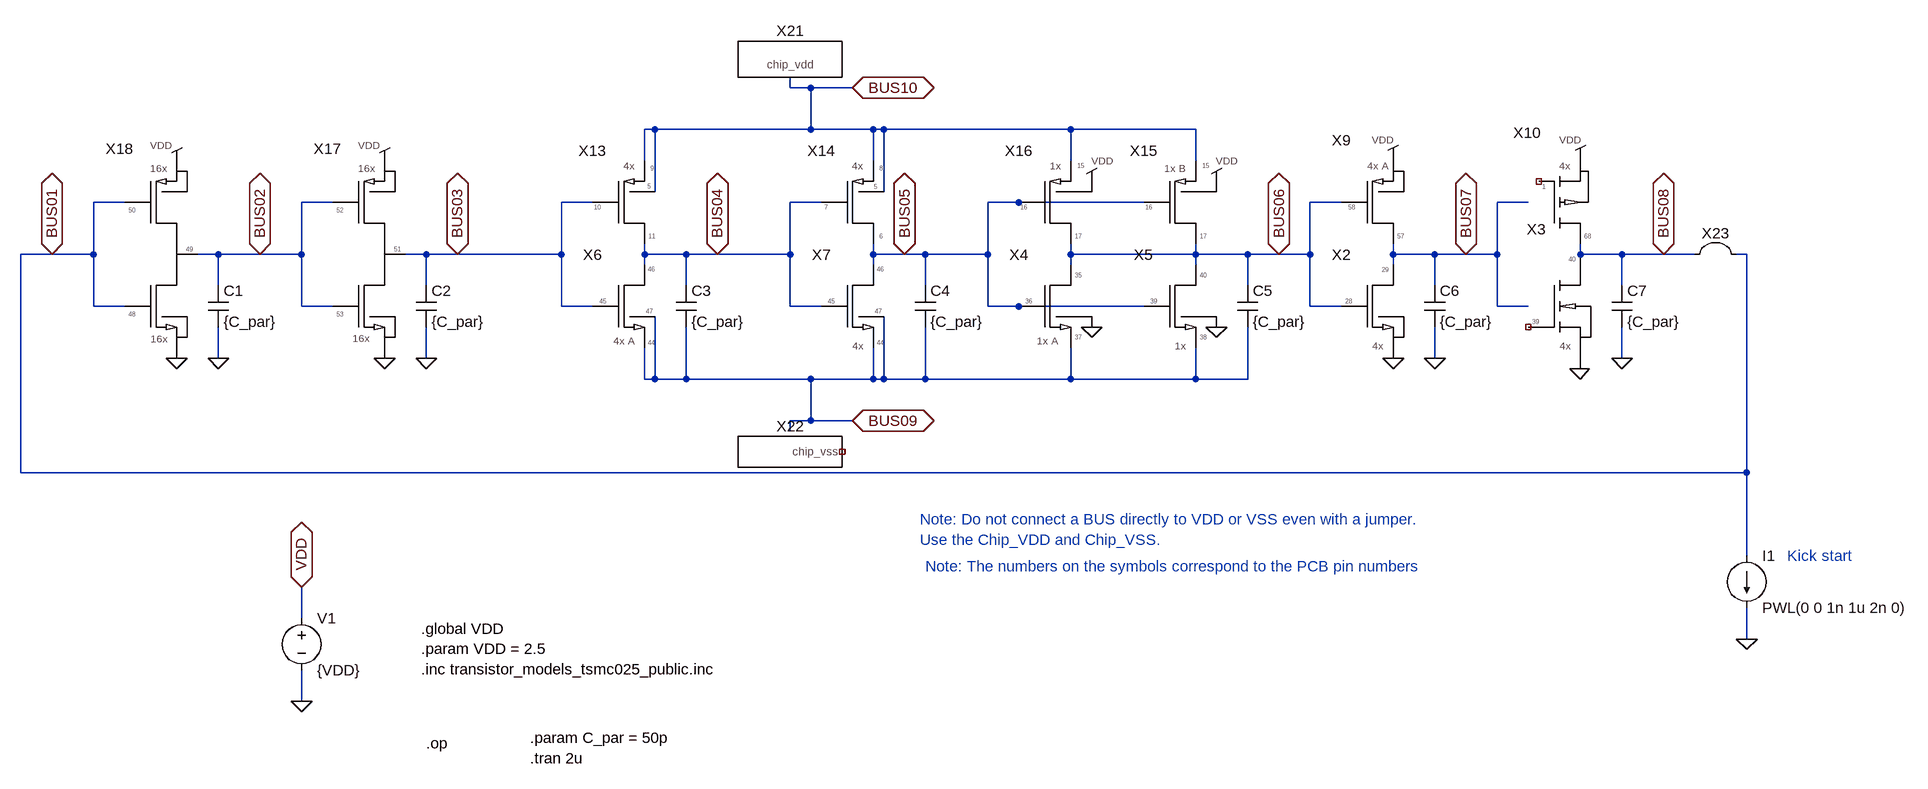
[diagram p0: schematic Example_Ring_Oscillator_7stage.asc]
Example_Ring_Oscillator_7stage.asc, the LTspice schematic file:
Version 4
SHEET 1 4480 996
WIRE 2752 -656 2752 -672
WIRE 2784 -656 2752 -656
WIRE 2848 -656 2784 -656
WIRE 2544 -592 2528 -592
WIRE 2784 -592 2784 -656
WIRE 2784 -592 2544 -592
WIRE 2880 -592 2784 -592
WIRE 2896 -592 2880 -592
WIRE 3184 -592 2896 -592
WIRE 3376 -592 3184 -592
WIRE 2528 -544 2528 -592
WIRE 2880 -544 2880 -592
WIRE 3184 -544 3184 -592
WIRE 3376 -544 3376 -592
WIRE 2544 -496 2544 -592
WIRE 2896 -496 2896 -592
WIRE 1728 -480 1680 -480
WIRE 2048 -480 2000 -480
WIRE 2448 -480 2400 -480
WIRE 2800 -480 2752 -480
WIRE 3104 -480 3056 -480
WIRE 3296 -480 3104 -480
WIRE 3600 -480 3552 -480
WIRE 3888 -480 3840 -480
WIRE 1616 -400 1568 -400
WIRE 1680 -400 1680 -480
WIRE 1680 -400 1616 -400
WIRE 1872 -400 1840 -400
WIRE 1936 -400 1872 -400
WIRE 2000 -400 2000 -480
WIRE 2000 -400 1936 -400
WIRE 2192 -400 2160 -400
WIRE 2240 -400 2192 -400
WIRE 2400 -400 2400 -480
WIRE 2400 -400 2240 -400
WIRE 2528 -400 2528 -416
WIRE 2592 -400 2528 -400
WIRE 2640 -400 2592 -400
WIRE 2752 -400 2752 -480
WIRE 2752 -400 2640 -400
WIRE 2880 -400 2880 -416
WIRE 2928 -400 2880 -400
WIRE 2960 -400 2928 -400
WIRE 3056 -400 3056 -480
WIRE 3056 -400 2960 -400
WIRE 3184 -400 3184 -416
WIRE 3376 -400 3376 -416
WIRE 3376 -400 3184 -400
WIRE 3456 -400 3376 -400
WIRE 3504 -400 3456 -400
WIRE 3552 -400 3552 -480
WIRE 3552 -400 3504 -400
WIRE 3680 -400 3680 -416
WIRE 3744 -400 3680 -400
WIRE 3792 -400 3744 -400
WIRE 3840 -400 3840 -480
WIRE 3840 -400 3792 -400
WIRE 3968 -400 3968 -416
WIRE 4032 -400 3968 -400
WIRE 4096 -400 4032 -400
WIRE 4144 -400 4096 -400
WIRE 4224 -400 4208 -400
WIRE 2528 -384 2528 -400
WIRE 2880 -384 2880 -400
WIRE 3184 -384 3184 -400
WIRE 3376 -384 3376 -400
WIRE 3680 -384 3680 -400
WIRE 3968 -384 3968 -400
WIRE 1872 -352 1872 -400
WIRE 2192 -352 2192 -400
WIRE 2592 -352 2592 -400
WIRE 2960 -352 2960 -400
WIRE 3456 -352 3456 -400
WIRE 3744 -352 3744 -400
WIRE 4032 -352 4032 -400
WIRE 1680 -320 1680 -400
WIRE 1728 -320 1680 -320
WIRE 2000 -320 2000 -400
WIRE 2048 -320 2000 -320
WIRE 2400 -320 2400 -400
WIRE 2448 -320 2400 -320
WIRE 2752 -320 2752 -400
WIRE 2800 -320 2752 -320
WIRE 3056 -320 3056 -400
WIRE 3104 -320 3056 -320
WIRE 3296 -320 3104 -320
WIRE 3552 -320 3552 -400
WIRE 3600 -320 3552 -320
WIRE 3840 -320 3840 -400
WIRE 3888 -320 3840 -320
WIRE 1872 -240 1872 -288
WIRE 2192 -240 2192 -288
WIRE 3744 -240 3744 -288
WIRE 4032 -240 4032 -288
WIRE 2528 -208 2528 -256
WIRE 2544 -208 2544 -304
WIRE 2544 -208 2528 -208
WIRE 2592 -208 2592 -288
WIRE 2592 -208 2544 -208
WIRE 2784 -208 2592 -208
WIRE 2880 -208 2880 -256
WIRE 2880 -208 2784 -208
WIRE 2896 -208 2896 -304
WIRE 2896 -208 2880 -208
WIRE 2960 -208 2960 -288
WIRE 2960 -208 2896 -208
WIRE 3184 -208 3184 -256
WIRE 3184 -208 2960 -208
WIRE 3376 -208 3376 -256
WIRE 3376 -208 3184 -208
WIRE 3456 -208 3456 -288
WIRE 3456 -208 3376 -208
WIRE 2784 -144 2784 -208
WIRE 2784 -144 2752 -144
WIRE 2848 -144 2784 -144
WIRE 2752 -128 2752 -144
WIRE 1568 -64 1568 -400
WIRE 4224 -64 4224 -400
WIRE 4224 -64 1568 -64
WIRE 4224 64 4224 -64
WIRE 2000 160 2000 112
WIRE 4224 192 4224 144
WIRE 2000 288 2000 240
FLAG 1616 -400 BUS01
IOPIN 1616 -400 BiDir
FLAG 1936 -400 BUS02
IOPIN 1936 -400 BiDir
FLAG 2240 -400 BUS03
IOPIN 2240 -400 BiDir
FLAG 2640 -400 BUS04
IOPIN 2640 -400 BiDir
FLAG 2928 -400 BUS05
IOPIN 2928 -400 BiDir
FLAG 3504 -400 BUS06
IOPIN 3504 -400 BiDir
FLAG 3792 -400 BUS07
IOPIN 3792 -400 BiDir
FLAG 4096 -400 BUS08
IOPIN 4096 -400 BiDir
FLAG 2848 -144 BUS09
IOPIN 2848 -144 BiDir
FLAG 2848 -656 BUS10
IOPIN 2848 -656 BiDir
FLAG 2000 112 VDD
IOPIN 2000 112 BiDir
FLAG 2000 288 0
FLAG 1872 -240 0
FLAG 4224 192 0
FLAG 2192 -240 0
FLAG 3744 -240 0
FLAG 4032 -240 0
SYMBOL DP_nMOS_1x_A 3136 -368 R0
SYMATTR InstName X4
SYMBOL DP_nMOS_1x_B 3328 -368 R0
SYMATTR InstName X5
SYMBOL CS_nMOS_4x_A 3632 -368 R0
SYMATTR InstName X2
SYMBOL DP_nMOS_4x_A 2480 -368 R0
SYMATTR InstName X6
SYMBOL DP_nMOS_4x_B 2832 -368 R0
SYMATTR InstName X7
SYMBOL voltage 2000 144 R0
SYMATTR InstName V1
SYMATTR Value {VDD}
SYMBOL CS_pMOS_4x_A 3616 -528 R0
SYMATTR InstName X9
SYMBOL CS_pMOS_4x_B 3904 -528 R0
SYMATTR InstName X10
SYMBOL CS_nMOS_4x_B 3920 -368 R0
SYMATTR InstName X3
SYMBOL DP_pMOS_4x_A 2464 -528 R0
SYMATTR InstName X13
SYMBOL DP_pMOS_4x_B 2816 -528 R0
SYMATTR InstName X14
SYMBOL DP_pMOS_1x_B 3312 -528 R0
SYMATTR InstName X15
SYMBOL DP_pMOS_1x_A 3120 -528 R0
SYMATTR InstName X16
SYMBOL inverter_A 2064 -528 R0
WINDOW 0 -24 -19 Bottom 2
SYMATTR InstName X17
SYMBOL inverter_B 1744 -528 R0
WINDOW 0 -24 -19 Bottom 2
SYMATTR InstName X18
SYMBOL chip_vdd 2752 -704 R0
SYMATTR InstName X21
SYMBOL chip_vss 2752 -96 R0
SYMATTR InstName X22
SYMBOL Misc/jumper 4176 -464 R0
SYMATTR InstName X23
SYMBOL Cap 1856 -352 R0
SYMATTR InstName C1
SYMATTR Value {C_par}
SYMBOL current 4224 64 R0
SYMATTR InstName I1
SYMATTR Value PWL(0 0 1n 1u 2n 0)
SYMBOL Cap 2176 -352 R0
SYMATTR InstName C2
SYMATTR Value {C_par}
SYMBOL Cap 2576 -352 R0
SYMATTR InstName C3
SYMATTR Value {C_par}
SYMBOL Cap 2944 -352 R0
SYMATTR InstName C4
SYMATTR Value {C_par}
SYMBOL Cap 3440 -352 R0
SYMATTR InstName C5
SYMATTR Value {C_par}
SYMBOL Cap 3728 -352 R0
SYMATTR InstName C6
SYMATTR Value {C_par}
SYMBOL Cap 4016 -352 R0
SYMATTR InstName C7
SYMATTR Value {C_par}
TEXT 2184 176 Left 2 !.global VDD\n.param VDD = 2.5\n.inc transistor_models_tsmc025_public.inc
TEXT 2192 352 Left 2 !.op
TEXT 2952 8 Left 2 ;Note: Do not connect a BUS directly to VDD or VSS even with a jumper. \nUse the Chip_VDD and Chip_VSS.
TEXT 2960 80 Left 2 ;Note: The numbers on the symbols correspond to the PCB pin numbers
TEXT 2352 344 Left 2 !.param C_par = 50p\n.tran 2u
TEXT 4336 64 Center 2 ;Kick start

The netlist it stands for:
* Example_Ring_Oscillator_7stage.asc
XX4 BUS05 BUS06 BUS09 DP_nMOS_1x_A  ; pins gate drain source
XX5 BUS05 BUS06 BUS09 DP_nMOS_1x_B  ; pins gate drain source
XX2 BUS06 BUS07 CS_nMOS_4x_A  ; pins gate drain
XX6 BUS03 BUS04 BUS09 BUS09 DP_nMOS_4x_A  ; pins gate drain source substrate
XX7 BUS04 BUS05 BUS09 BUS09 DP_nMOS_4x_B  ; pins gate drain source substrate
V1 VDD 0 {VDD}
XX9 BUS07 BUS06 CS_pMOS_4x_A  ; pins drain gate
XX10 BUS08 NC_01 CS_pMOS_4x_B  ; pins drain gate
XX3 NC_02 BUS08 CS_nMOS_4x_B  ; pins gate drain
XX13 BUS04 BUS03 BUS10 BUS10 DP_pMOS_4x_A  ; pins drain gate source nwell
XX14 BUS05 BUS04 BUS10 BUS10 DP_pMOS_4x_B  ; pins drain gate source nwell
XX15 BUS06 BUS05 BUS10 DP_pMOS_1x_B  ; pins drain gate source
XX16 BUS06 BUS05 BUS10 DP_pMOS_1x_A  ; pins drain gate source
XX17 BUS02 BUS02 BUS03 inverter_A  ; pins inn inp out
XX18 BUS08 BUS08 BUS02 inverter_B  ; pins inn inp out
XX21 BUS10 chip_vdd  ; pins chip_vdd
XX22 NC_03 chip_vss  ; pins chip_vss
C1 BUS02 0 {C_par}
I1 BUS08 0 PWL(0 0 1n 1u 2n 0)
C2 BUS03 0 {C_par}
C3 BUS04 BUS09 {C_par}
C4 BUS05 BUS09 {C_par}
C5 BUS06 BUS09 {C_par}
C6 BUS07 0 {C_par}
C7 BUS08 0 {C_par}
.global VDD
.param VDD = 2.5
.inc transistor_models_tsmc025_public.inc
.op
* Note: Do not connect a BUS directly to VDD or VSS even with a jumper.
* Use the Chip_VDD and Chip_VSS.
* Note: The numbers on the symbols correspond to the PCB pin numbers
.param C_par = 50p
.tran 2u
* Kick start
.backanno
.end